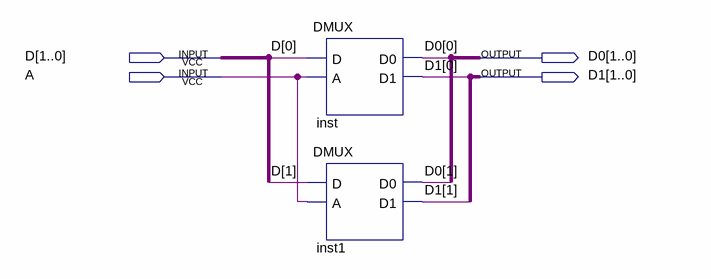
[diagram p0: schematic sheet]
// Quartus schematic DMUX2.bdf as structural Verilog: 2 symbols, 4 pins
module DMUX2 (
  input  [1:0] D,
  input  A,
  output [1:0] D0,
  output [1:0] D1
);

  DMUX inst (.D(D[0]), .A(A), .D0(D0[0]), .D1(D1[0]));
  DMUX inst1 (.D(D[1]), .A(A), .D0(D0[1]), .D1(D1[1]));
endmodule
